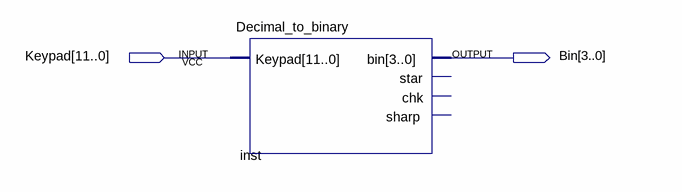
[diagram p0: schematic sheet]
// Quartus schematic FPGAKeypadBinaryLED.bdf as structural Verilog: 1 symbols, 2 pins
module FPGAKeypadBinaryLED (
  input  [11:0] Keypad,
  output [3:0] Bin
);

  Decimal_to_binary inst (.Keypad(Keypad), .bin(Bin));  // open: star, chk, sharp
endmodule
